# Altium schematic sheet wk.SchDoc
size A4; SheetNumber: 1; SheetTotal: 1
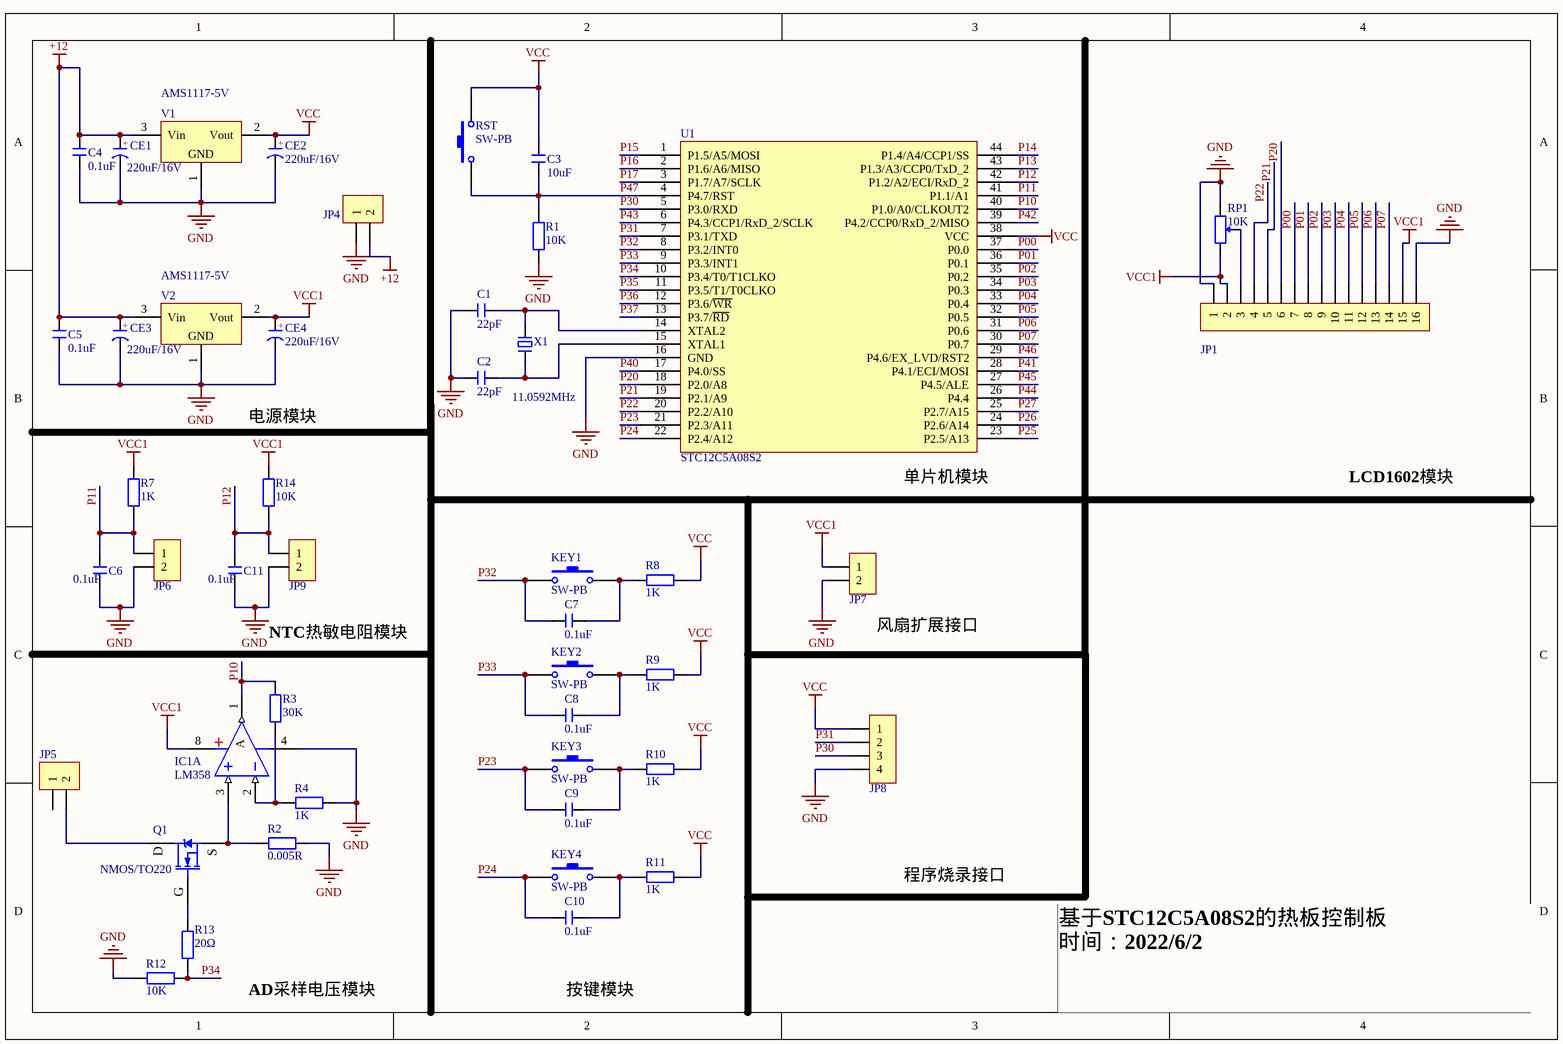
[diagram p0: wk.SchDoc]

## Parts
C1  22pF  [C 0805_M]
C2  22pF  [C 0805_M]
C3  10uF  [C 0805_M]
C4  0.1uF  [C 0805_M]
C5  0.1uF  [C 0805_M]
C6  0.1uF  [C 0805_M]
C7  0.1uF  [C 0805_M]
C8  0.1uF  [C 0805_M]
C9  0.1uF  [C 0805_M]
C10  0.1uF  [C 0805_M]
C11  0.1uF  [C 0805_M]
CE1  220uF/16V  [CAP 2.5*6.3*7]
CE2  220uF/16V  [CAP 2.5*6.3*7]
CE3  220uF/16V  [CAP 2.5*6.3*7]
CE4  220uF/16V  [CAP 2.5*6.3*7]
IC1  LM358  [DIP8-300]  (part A of 2)
JP1  HDR-1X16  [HDR2.54-LI-16P]  (value not drawn)
JP4  HDR-1X2  [KF2EDGK5.08-LI-2P]  (value not drawn)
JP5  HDR-1X2  [KF2EDGK5.08-LI-2P]  (value not drawn)
JP6  HDR-1X2  [HDR2.54-LI-2P]  (value not drawn)
JP7  HDR-1X2  [HDR2.54-LI-2P]  (value not drawn)
JP8  HDR-1X4  [HDR2.54-LI-4P]  (value not drawn)
JP9  HDR-1X2  [HDR2.54-LI-2P]  (value not drawn)
KEY1  SW-PB  [SW_PB2_A1]
KEY2  SW-PB  [SW_PB2_A1]
KEY3  SW-PB  [SW_PB2_A1]
KEY4  SW-PB  [SW_PB2_A1]
Q1  NMOS/TO220  [TO220A]
R1  10K  [RS 1/8W]
R2  0.005R  [RI 1.25W - 0.9mm]
R3  30K  [RS 1/8W]
R4  1K  [RS 1/8W]
R7  1K  [RS 1/8W]
R8  1K  [RS 1/8W]
R9  1K  [RS 1/8W]
R10  1K  [RS 1/8W]
R11  1K  [RS 1/8W]
R12  10K  [RS 1/8W]
R13  20Ω  [RS 1/8W]
R14  10K  [RS 1/8W]
RP1  10K  [3362P]
RST  SW-PB  [SW_PB2_A1]
U1  STC12C5A08S2  [LQFP44 10x10_L]
V1  AMS1117-5V  [SOT223_L]
V2  AMS1117-5V  [SOT223_L]
X1  11.0592MHz  [OSC 5032-2P]

## Nets
+12: C4.2 C5.2 CE1.1(A) CE3.1(A) JP4.2 V1.3(Vin) V2.3(Vin)
GND: C1.2 C2.2 C4.1 C5.1 C6.1 C11.1 CE1.2(K) CE2.2(K) CE3.2(K) CE4.2(K) IC1.4(V-) JP1.1 JP1.16 JP4.1 JP6.2 JP7.2 JP8.4 JP9.2 R1.1 R2.2 R4.2 R12.2 RP1.1 U1.16(GND) V1.1(GND) V2.1(GND)
VCC: C3.2 CE2.1(A) JP8.1 R8.1 R9.1 R10.1 R11.1 RST.2 U1.38(VCC) V1.2(Vout)
VCC1: CE4.1(A) IC1.8(V+) JP1.2 JP1.15 JP7.1 R7.2 R14.2 RP1.3 V2.2(Vout)
P00: JP1.7 U1.37(P0.0)
P01: JP1.8 U1.36(P0.1)
P02: JP1.9 U1.35(P0.2)
P03: JP1.10 U1.34(P0.3)
P04: JP1.11 U1.33(P0.4)
P05: JP1.12 U1.32(P0.5)
P06: JP1.13 U1.31(P0.6)
P07: JP1.14 U1.30(P0.7)
P10: IC1.1(OUT) R3.1 U1.40(P1.0/A0/CLKOUT2)
P11: C6.2 JP6.1 R7.1 U1.41(P1.1/A1)
P12: C11.2 JP9.1 R14.1 U1.42(P1.2/A2/ECI/RxD_2)
P13: U1.43(P1.3/A3/CCP0/TxD_2)
P14: U1.44(P1.4/A4/CCP1/SS)
P15: U1.1(P1.5/A5/MOSI)
P16: U1.2(P1.6/A6/MISO)
P17: U1.3(P1.7/A7/SCLK)
P20: JP1.6 U1.18(P2.0/A8)
P21: JP1.5 U1.19(P2.1/A9)
P22: JP1.4 U1.20(P2.2/A10)
P23: C9.2 KEY3.1 U1.21(P2.3/A11)
P24: C10.2 KEY4.1 U1.22(P2.4/A12)
P25: U1.23(P2.5/A13)
P26: U1.24(P2.6/A14)
P27: U1.25(P2.7/A15)
P30: JP8.3 U1.5(P3.0/RXD)
P31: JP8.2 U1.7(P3.1/TXD)
P32: C7.2 KEY1.1 U1.8(P3.2/INT0)
P33: C8.2 KEY2.1 U1.9(P3.3/INT1)
P34: R12.1 R13.2 U1.10(P3.4/T0/T1CLKO)
P35: U1.11(P3.5/T1/T0CLKO)
P36: U1.12(P3.6/~{WR})
P37: U1.13(P3.7/~{RD})
P40: U1.17(P4.0/SS)
P41: U1.28(P4.1/ECI/MOSI)
P42: U1.39(P4.2/CCP0/RxD_2/MISO)
P43: U1.6(P4.3/CCP1/RxD_2/SCLK)
P44: U1.26(P4.4)
P45: U1.27(P4.5/ALE)
P46: U1.29(P4.6/EX_LVD/RST2)
P47: C3.1 R1.2 RST.1 U1.4(P4.7/RST)
NetC1_1: C1.1 U1.14(XTAL2) X1.2
NetC2_1: C2.1 U1.15(XTAL1) X1.1
NetC7_1: C7.1 KEY1.2 R8.2
NetC8_1: C8.1 KEY2.2 R9.2
NetC9_1: C9.1 KEY3.2 R10.2
NetC10_1: C10.1 KEY4.2 R11.2
NetIC1_2: IC1.2(IN-) R3.2 R4.1
NetIC1_3: IC1.3(IN+) Q1.3(S) R2.1
NetJP1_3: JP1.3 RP1.2
NetJP5_2: JP5.2 Q1.2(D)
NetQ1_1: Q1.1(G) R13.1

Not connected (* = marked no-connect by the designer): JP5 1

## Notes on the sheet
- 电源模块
- (near U1) 单片机模块
- LCD1602模块
- NTC热敏电阻模块
- (near JP7) 风扇扩展接口
- 程序烧录接口
- AD采样电压模块
- 按键模块
- 基于STC12C5A08S2的热板控制板
  时间：2022/6/2
- (in symbol CE) +
- (in symbol LM358, part A) A

## Library data of the parts
C1-C11 = C: 贴片电容; BOM名称: 无极性贴片电容; 淘宝ID: 封装库来自淘宝 ID：黄晶宝石; 联系售后，技术支持: https://shop463601444.taobao.com; 唯一出售店铺网址: https://shop463601444.taobao.com
CE1-CE4 = CE: 直插电解电容; 淘宝ID: 封装库来自淘宝 ID：黄晶宝石; BOM名称: 直插电解电容; 联系售后: https://shop463601444.taobao.com
IC1 = LM358: 双路运放; 版权归属: 源创客; BOM名称: 双路运放; 封装库来自淘宝 ID：黄晶宝石: https://shop463601444.taobao.com
JP1 = Header 16: 16P接插件; 版权归属: 源创客; BOM名称: 16P接插件; 学习资源: www.ooocke.com
JP4 JP5 = Header 2: 2P接插件; 版权归属: 源创客; BOM名称: 2P接插件; 学习资源: www.ooocke.com
JP6 JP7 JP9 = Header 2: 2P接插件; 版权归属: 封装库来自淘宝 ID：黄晶宝石; BOM名称: 2P接插件; 联系售后: https://shop463601444.taobao.com
JP8 = Header 4: 4P接插件; 版权归属: 封装库来自淘宝 ID：黄晶宝石; BOM名称: 4P接插件; 学习资源: https://shop463601444.taobao.com
KEY1-KEY4 RST = SW-PB: 微动开关; Published: 24-Mar-1999; LatestRevisionDate: 17-Jul-2002; LatestRevisionNote: Re-released for DXP Platform.; PackageReference: SPST-2; Publisher: Altium Limited
Q1 = IRF840: N沟场效应管; BOM名称: N沟场效应管; 技术支持，联系售后: https://shop463601444.taobao.com
R1 R3 R4 R7-R14 = R-S: 色环电阻; 版权归属: 封装库来自淘宝 ID：黄晶宝石; BOM名称: 色环电阻; 联系售后: https://shop463601444.taobao.com
R2 = R-I: 电流检测电阻; 版权归属: 源创客; BOM名称: 电流检测电阻; 学习资源: www.ooocke.com
RP1 = RP: 单联电位器; BOM名称: 插件电位器; 版权归属: 封装库来自淘宝 ID：黄晶宝石; 联系售后: https://shop463601444.taobao.com
U1 = STC12C5AxxS2-44pin: STC单片机; 版权归属: 封装库来自淘宝卖家 ID：黄晶宝石; BOM名称: STC单片机; 学习资源: https://shop463601444.taobao.com
V1 V2 = AMS1117: 三端稳压芯片; BOM名称: 稳压芯片; 淘宝ID: 封装库来自淘宝 ID：黄晶宝石; 欢迎光临淘宝店铺: https://shop463601444.taobao.com
X1 = XTAL-2P: 2脚无源脚晶振; 版权归属: 封装库来自淘宝卖家 ID：黄晶宝石; BOM名称: 2脚无源脚晶振; 学习资源: https://shop463601444.taobao.com